# Altium schematic sheet 07_ux.SchDoc
size B
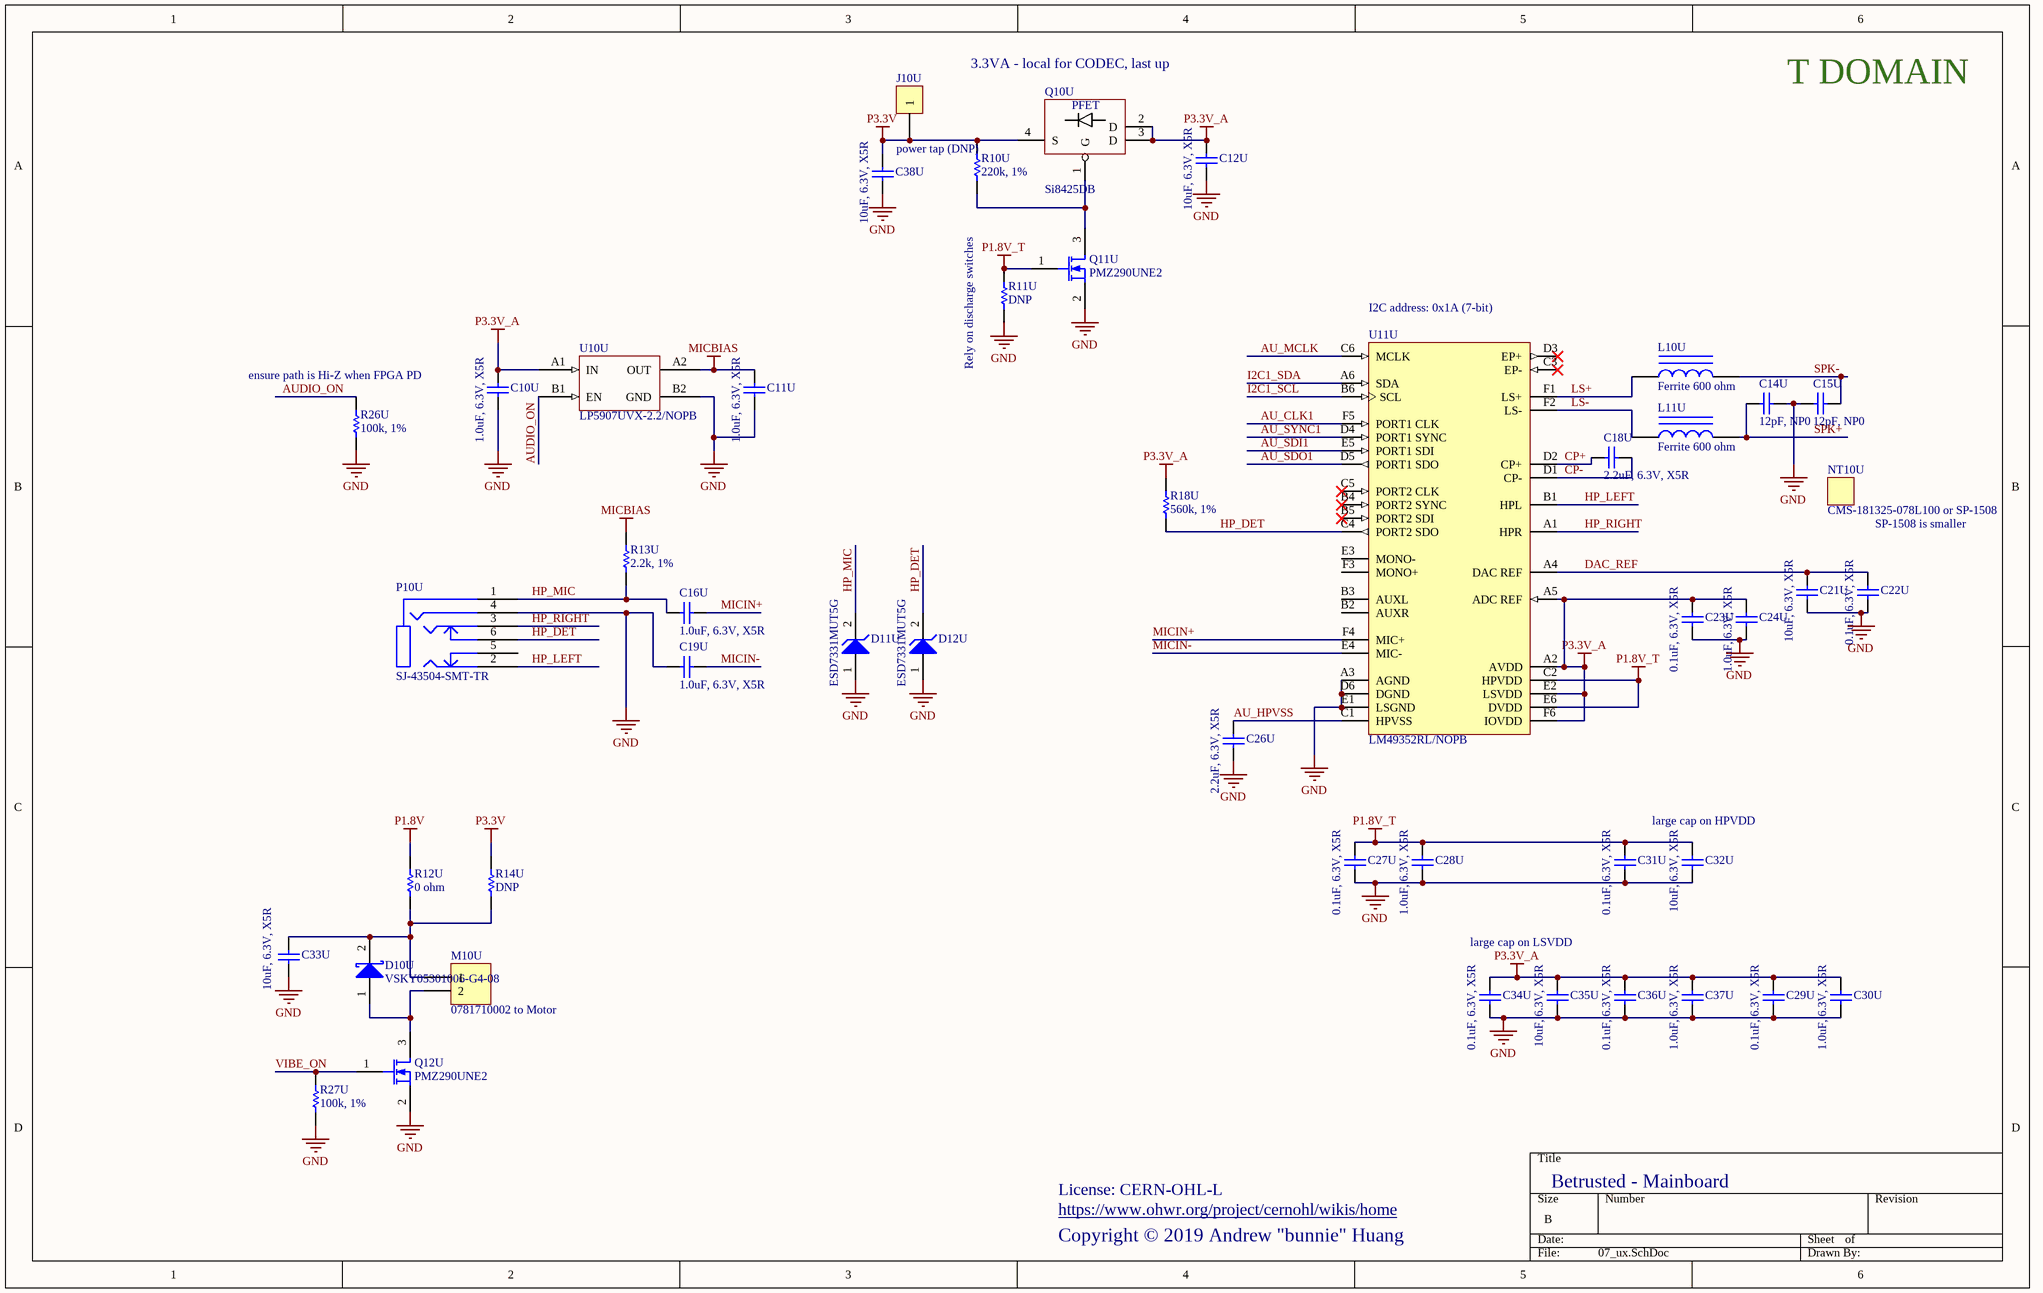
[diagram p0: 07_ux.SchDoc]

## Parts
C10U  1.0uF, 6.3V, X5R  [B_CAP0201]
C11U  1.0uF, 6.3V, X5R  [B_CAP0201]
C12U  10uF, 6.3V, X5R  [B_CAP0603]
C14U  12pF, NP0  [B_CAP0201]
C15U  12pF, NP0  [B_CAP0201]
C16U  1.0uF, 6.3V, X5R  [B_CAP0201]
C18U  2.2uF, 6.3V, X5R  [B_CAP0402]
C19U  1.0uF, 6.3V, X5R  [B_CAP0201]
C21U  10uF, 6.3V, X5R  [B_CAP0603]
C22U  0.1uF, 6.3V, X5R  [B_CAP0201]
C23U  0.1uF, 6.3V, X5R  [B_CAP0201]
C24U  1.0uF, 6.3V, X5R  [B_CAP0201]
C26U  2.2uF, 6.3V, X5R  [B_CAP0402]
C27U  0.1uF, 6.3V, X5R  [B_CAP0201]
C28U  1.0uF, 6.3V, X5R  [B_CAP0201]
C29U  0.1uF, 6.3V, X5R  [B_CAP0201]
C30U  1.0uF, 6.3V, X5R  [B_CAP0201]
C31U  0.1uF, 6.3V, X5R  [B_CAP0201]
C32U  10uF, 6.3V, X5R  [B_CAP0603]
C33U  10uF, 6.3V, X5R  [B_CAP0603]
C34U  0.1uF, 6.3V, X5R  [B_CAP0201]
C35U  10uF, 6.3V, X5R  [B_CAP0603]
C36U  0.1uF, 6.3V, X5R  [B_CAP0201]
C37U  1.0uF, 6.3V, X5R  [B_CAP0201]
C38U  10uF, 6.3V, X5R  [B_CAP0603]
D10U  VSKY05301006-G4-08  [B_DIO0402]
D11U  ESD7331MUT5G  [D_X3DFN2_0201]
D12U  ESD7331MUT5G  [D_X3DFN2_0201]
J10U  power tap (DNP)  [RESTAP-0603]
L10U  Ferrite 600 ohm  [B_IND0603]
L11U  Ferrite 600 ohm  [B_IND0603]
M10U  0781710002 to Motor  [MOLEX_0781710002]
NT10U  CMS-181325-078L100 or SP-1508
P10U  SJ-43504-SMT-TR  [CUI_SJ_43504_SMT_TR_FLIP]
Q10U  Si8425DB  [VISHAY_MICRO_FOOT_4_BUMP]
Q11U  PMZ290UNE2  [SOT883]
Q12U  PMZ290UNE2  [SOT883]
R10U  220k, 1%  [B_RES0201]
R11U  DNP  [B_RES0201]
R12U  0 ohm  [B_RES0201]
R13U  2.2k, 1%  [B_RES0201]
R14U  DNP  [B_RES0201]
R18U  560k, 1%  [B_RES0201]
R26U  100k, 1%  [B_RES0201]
R27U  100k, 1%  [B_RES0201]
U10U  LP5907UVX-2.2/NOPB  [TI_YKE004]
U11U  LM49352RL/NOPB  [YPG0036AWAW]

## Nets
GND: C10U.2 C11U.2 C12U.2 C14U.2 C15U.1 C19U.1 C21U.2 C22U.2 C23U.2 C24U.1 C26U.1 C27U.2 C28U.1 C29U.2 C30U.1 C31U.2 C32U.2 C33U.1 C34U.2 C35U.2 C36U.2 C37U.1 C38U.2 D11U.1(A) D12U.1(A) P10U.4(RING2) Q11U.2(S) Q12U.2(S) R11U.1 R26U.1 R27U.1 U10U.B2(GND) U11U.A3(AGND) U11U.D6(DGND) U11U.E1(LSGND)
MICBIAS: C11U.1 R13U.2 U10U.A2(OUT)
P1.8V: R12U.2
P1.8V_T: C27U.1 C28U.2 C31U.1 C32U.1 Q11U.1(G) R11U.2 U11U.C2(HPVDD) U11U.E6(DVDD)
P3.3V: C38U.1 J10U.1 Q10U.4(S) R10U.2 R14U.1
P3.3V_A: C10U.1 C12U.1 C23U.1 C24U.2 C29U.1 C30U.2 C34U.1 C35U.1 C36U.1 C37U.2 Q10U.2(D) Q10U.3(D) R18U.2 U10U.A1(IN) U11U.A2(AVDD) U11U.A5(ADC_REF) U11U.E2(LSVDD) U11U.F6(IOVDD)
AU_CLK1: U11U.F5(PORT1_CLK)
AU_HPVSS: C26U.2 U11U.C1(HPVSS)
AU_MCLK: U11U.C6(MCLK)
AU_SDI1: U11U.E5(PORT1_SDI)
AU_SDO1: U11U.D5(PORT1_SDO)
AU_SYNC1: U11U.D4(PORT1_SYNC)
AUDIO_ON: R26U.2 U10U.B1(EN)
CP+: C18U.2 U11U.D2(CP+)
CP-: C18U.1 U11U.D1(CP-)
DAC_REF: C21U.1 C22U.1 U11U.A4(DAC_REF)
HP_DET: D12U.2(K) P10U.6(RING1_SW) R18U.1 U11U.C4(PORT2_SDO)
HP_LEFT: P10U.2(TIP) U11U.B1(HPL)
HP_MIC: C16U.1 D11U.2(K) P10U.1(SLEEVE) R13U.1
HP_RIGHT: P10U.3(RING1) U11U.A1(HPR)
I2C1_SCL: U11U.B6(SCL)
I2C1_SDA: U11U.A6(SDA)
LS+: L10U.1 U11U.F1(LS+)
LS-: L11U.1 U11U.F2(LS-)
MICIN+: C16U.2 U11U.F4(MIC+)
MICIN-: C19U.2 U11U.E4(MIC-)
SPK+: C14U.1 L11U.2
SPK-: C15U.2 L10U.2
VIBE_ON: Q12U.1(G) R27U.2
NetC33U_2: C33U.2 D10U.2(K) M10U.1 R12U.1 R14U.2
NetD10U_1: D10U.1(A) M10U.2 Q12U.3(D)
NetQ10U_1: Q10U.1(G) Q11U.3(D) R10U.1

Not connected (* = marked no-connect by the designer): P10U 5(TIP_SW); U11U B2(AUXR) B3(AUXL) B4(PORT2_SYNC)* B5(PORT2_SDI)* C3(EP-)* C5(PORT2_CLK)* D3(EP+)* E3(MONO-) F3(MONO+)

## Notes on the sheet
- 3.3VA - local for CODEC, last up
- T DOMAIN
- Rely on discharge switches
- (near U11U) I2C address: 0x1A (7-bit)
- (near R26U) ensure path is Hi-Z when FPGA PD
- SP-1508 is smaller
- large cap on HPVDD
- large cap on LSVDD
- License: CERN-OHL-L
- Copyright © 2019 Andrew "bunnie" Huang
- https://www.ohwr.org/project/cernohl/wikis/home
- Betrusted - Mainboard
- (in symbol Si8425DB) PFET

## Library data of the parts
C10U C11U C16U C19U = Cap Semi: Capacitor (Semiconductor SIM Model); MPN: GRM033R60J105MEA2D; VENDOR: Murata; MYPN: C-105-6p3-X5R-0603
C12U C21U C32U C33U C35U C38U = Cap Semi: Capacitor (Semiconductor SIM Model); MPN: CL10A106MQ8NNNC; VENDOR: Samsung; MYPN: C-106-6.3-X5R-0603
C14U C15U = Cap Semi: Capacitor (Semiconductor SIM Model); MPN: GRM0335C1E120JA01D; VENDOR: Murata; MYPN: C-120-25-NP0-0201
C18U C26U = Cap Semi: Capacitor (Semiconductor SIM Model); MPN: CL05A225MQ5NNNC; VENDOR: Samsung; MYPN: C-225-6p3-X5R-0402
C22U C23U C27U C29U C31U C34U C36U = Cap Semi: Capacitor (Semiconductor SIM Model); MPN: CL03A104KQ3NNNC; VENDOR: Samsung; MYPN: C-104-6p3-X5R-0201
C24U C28U C30U C37U = Cap Semi: Capacitor (Semiconductor SIM Model); MPN: GRM033R60J105MEA2D; VENDOR: Murata; MYPN: C-105-6p3-X5R-0201
D10U = Diode 11DQ03: Schottky Rectifier; MYPN: D-SCHOTTKY-0402-CSP; VENDOR: Vishay; ComponentLink1Description: Manufacturer Link; ComponentLink1URL: http://www.irf.com/; ComponentLink2Description: Datasheet; ComponentLink2URL: http://www.irf.com/product-info/datasheets/data/11dq03.pdf; MPN: VSKY05301006-G4-08
D11U D12U = D Zener: VENDOR: ON Semi; MYPN: D-ESD7331MUT5G; Published: 8-Jun-2000; LatestRevisionDate: 17-Jul-2002; LatestRevisionNote: Re-released for DXP Platform.; PackageReference: DIODE-0.7; Publisher: Altium Limited; PackageDescription: Diode, Thru-Hole; 2 Leads; 0.7 in Pin Spacing; MPN: ESD7331MUT5G
J10U = CON1: Connector; MYPN: J-TP-PWRTAP-0603; MPN: DNP; VENDOR: DNP
L10U L11U = Inductor Iron: Magnetic-Core Inductor; MPN: BLM18AG601SN1D; VENDOR: Murata; MYPN: L-BLM18AG601SN1D
M10U = Header 2: Vibration motor, mid-mount 10mm; VENDOR: Molex; MYPN: J-0781710002; LatestRevisionDate: 17-Jul-2002; LatestRevisionNote: Re-released for DXP Platform.; Publisher: Altium Limited; MPN: 0781710002
NT10U = NOTE: Placeholder for non-board BOM items; MYPN: NT-CUI-SPEAKER; VENDOR: CUI or Soberton; MPN: CMS-181325-078L100 or SP-1508
P10U = CUI_3.5MM_STEREO_MIC: Mid mount audio jack; VENDOR: CUI; MYPN: J-3.5MM-MID-CUI; MPN: SJ-43504-SMT-TR
Q10U = Si8425DB: P-channel 20V 6.2A 27mOhm @ -2.5V; MPN: SI8457DB-T1-E1; VENDOR: Vishay Siliconix; MYPN: Q-Si8457
Q11U Q12U = MOSFET-N: N-Channel MOSFET; VENDOR: Nexperia; MYPN: Q-PMZ290UNE2; Published: 8-Jun-2000; LatestRevisionDate: 17-Jul-2002; LatestRevisionNote: Re-released for DXP Platform.; PackageVersion: 1995/1996; PackageReference: E3; Publisher: Altium Limited; MPN: PMZ290UNE2
R10U = Res1: Resistor; VENDOR: ANY; MYPN: R-224-1P-1_16W-0201; MPN: ANY
R11U R14U = Res1: Resistor; VENDOR: ANY; MYPN: DNP; MPN: ANY
R12U = Res1: Resistor; VENDOR: ANY; MYPN: R-0R0-1P-1_16W-0201; MPN: ANY
R13U = Res1: Resistor; VENDOR: ANY; MYPN: R-222-1P-1_16W-0201; MPN: ANY
R18U = Res1: Resistor; VENDOR: ANY; MYPN: R-564-1P-1_16W-0201; MPN: ANY
R26U R27U = Res1: Resistor; VENDOR: ANY; MYPN: R-104-1P-1_16W-0201; MPN: ANY
U10U = LP5907UVX: Ultra low-noise 250mA LDO for RF and analog in DSBGA; VENDOR: TI; MYPN: ULP5907UVX-2.2; MPN: LP5907UVX-2.2/NOPB
U11U = AMP-AUDA-LM49352-36: MYPN: U-LM49352RL/NOPB; VENDOR: TI; MPN: LM49352RL/NOPB